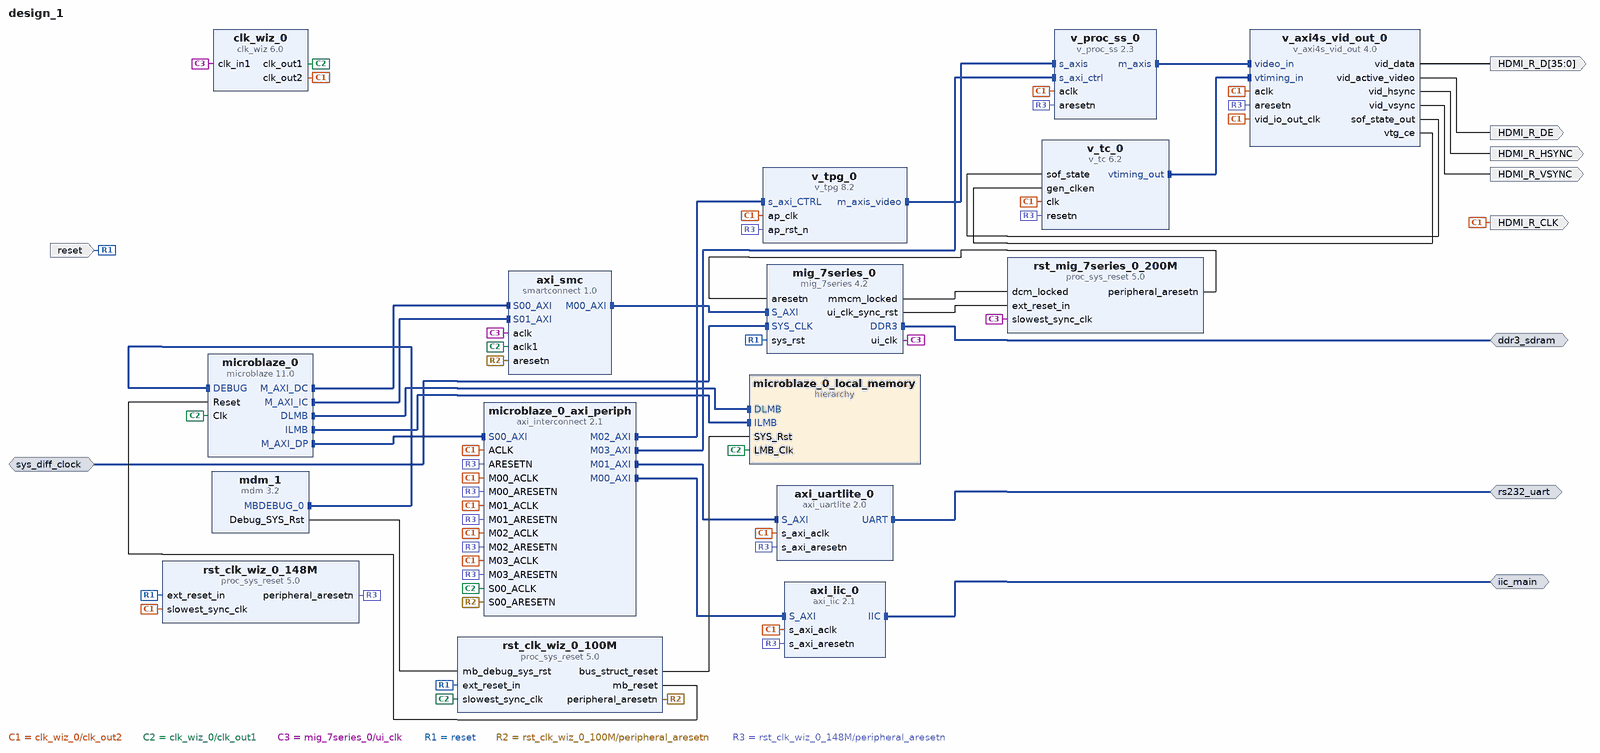
[diagram p0: block diagram of the top level]
# Vivado block design design_1, xc7vx485tffg1761-2, Vivado 2023.2
create_bd_design design_1

create_bd_intf_port -mode Master -vlnv xilinx.com:interface:ddrx_rtl:1.0 ddr3_sdram
create_bd_intf_port -mode Slave -vlnv xilinx.com:interface:diff_clock_rtl:1.0 sys_diff_clock
create_bd_intf_port -mode Master -vlnv xilinx.com:interface:iic_rtl:1.0 iic_main
create_bd_intf_port -mode Master -vlnv xilinx.com:interface:uart_rtl:1.0 rs232_uart
create_bd_port -dir O HDMI_R_DE
create_bd_port -dir O -from 35 -to 0 HDMI_R_D
create_bd_port -dir O HDMI_R_HSYNC
create_bd_port -dir O HDMI_R_VSYNC
create_bd_port -dir I -type rst reset
set_property -dict {CONFIG.POLARITY ACTIVE_HIGH} [get_bd_ports reset]
create_bd_port -dir O -type clk HDMI_R_CLK

create_bd_cell -type ip -vlnv xilinx.com:ip:v_proc_ss:2.3 v_proc_ss_0
set_property -dict [list \
  CONFIG.C_COLORSPACE_SUPPORT 2 \
  CONFIG.C_MAX_DATA_WIDTH 12 \
  CONFIG.C_SAMPLES_PER_CLK 1 \
  CONFIG.C_TOPOLOGY 3 \
] [get_bd_cells v_proc_ss_0]
create_bd_cell -type ip -vlnv xilinx.com:ip:v_axi4s_vid_out:4.0 v_axi4s_vid_out_0
set_property -dict [list \
  CONFIG.C_HAS_ASYNC_CLK 1 \
  CONFIG.C_NATIVE_COMPONENT_WIDTH 12 \
  CONFIG.C_S_AXIS_VIDEO_FORMAT 2 \
] [get_bd_cells v_axi4s_vid_out_0]
create_bd_cell -type ip -vlnv xilinx.com:ip:axi_uartlite:2.0 axi_uartlite_0
set_property -dict {CONFIG.UARTLITE_BOARD_INTERFACE rs232_uart CONFIG.USE_BOARD_FLOW true} [get_bd_cells axi_uartlite_0]
create_bd_cell -type ip -vlnv xilinx.com:ip:axi_iic:2.1 axi_iic_0
set_property -dict {CONFIG.IIC_BOARD_INTERFACE iic_main CONFIG.USE_BOARD_FLOW true} [get_bd_cells axi_iic_0]
create_bd_cell -type ip -vlnv xilinx.com:ip:mig_7series:4.2 mig_7series_0
set_property -dict {CONFIG.BOARD_MIG_PARAM ddr3_sdram CONFIG.RESET_BOARD_INTERFACE reset} [get_bd_cells mig_7series_0]
create_bd_cell -type ip -vlnv xilinx.com:ip:v_tc:6.2 v_tc_0
set_property -dict {CONFIG.HAS_AXI4_LITE false CONFIG.VIDEO_MODE 1080p CONFIG.enable_detection false} [get_bd_cells v_tc_0]
create_bd_cell -type ip -vlnv xilinx.com:ip:v_tpg:8.2 v_tpg_0
set_property -dict {CONFIG.MAX_DATA_WIDTH 12} [get_bd_cells v_tpg_0]
create_bd_cell -type ip -vlnv xilinx.com:ip:clk_wiz:6.0 clk_wiz_0
set_property -dict [list \
  CONFIG.CLKOUT1_JITTER 115.612 \
  CONFIG.CLKOUT1_PHASE_ERROR 87.466 \
  CONFIG.CLKOUT2_JITTER 107.413 \
  CONFIG.CLKOUT2_PHASE_ERROR 87.466 \
  CONFIG.CLKOUT2_REQUESTED_OUT_FREQ 148.5 \
  CONFIG.CLKOUT2_USED true \
  CONFIG.MMCM_CLKFBOUT_MULT_F 11.875 \
  CONFIG.MMCM_CLKOUT0_DIVIDE_F 11.875 \
  CONFIG.MMCM_CLKOUT1_DIVIDE 8 \
  CONFIG.NUM_OUT_CLKS 2 \
  CONFIG.USE_LOCKED false \
  CONFIG.USE_RESET false \
] [get_bd_cells clk_wiz_0]
create_bd_cell -type ip -vlnv xilinx.com:ip:microblaze:11.0 microblaze_0
set_property -dict [list \
  CONFIG.C_CACHE_BYTE_SIZE 8192 \
  CONFIG.C_DCACHE_BYTE_SIZE 8192 \
  CONFIG.C_DEBUG_ENABLED 1 \
  CONFIG.C_D_AXI 1 \
  CONFIG.C_D_LMB 1 \
  CONFIG.C_I_LMB 1 \
  CONFIG.C_USE_DCACHE 1 \
  CONFIG.C_USE_ICACHE 1 \
] [get_bd_cells microblaze_0]
create_bd_cell -type hier microblaze_0_local_memory
create_bd_cell -type ip -vlnv xilinx.com:ip:mdm:3.2 mdm_1
create_bd_cell -type ip -vlnv xilinx.com:ip:proc_sys_reset:5.0 rst_clk_wiz_0_100M
set_property -dict {CONFIG.RESET_BOARD_INTERFACE reset CONFIG.USE_BOARD_FLOW true} [get_bd_cells rst_clk_wiz_0_100M]
create_bd_cell -type ip -vlnv xilinx.com:ip:axi_interconnect:2.1 microblaze_0_axi_periph
set_property -dict {CONFIG.NUM_MI 4} [get_bd_cells microblaze_0_axi_periph]
create_bd_cell -type ip -vlnv xilinx.com:ip:proc_sys_reset:5.0 rst_clk_wiz_0_148M
set_property -dict {CONFIG.RESET_BOARD_INTERFACE reset CONFIG.USE_BOARD_FLOW true} [get_bd_cells rst_clk_wiz_0_148M]
create_bd_cell -type ip -vlnv xilinx.com:ip:smartconnect:1.0 axi_smc
set_property -dict {CONFIG.NUM_CLKS 2 CONFIG.NUM_SI 2} [get_bd_cells axi_smc]
create_bd_cell -type ip -vlnv xilinx.com:ip:proc_sys_reset:5.0 rst_mig_7series_0_200M

# ---- hierarchy /microblaze_0_local_memory ----
current_bd_instance /microblaze_0_local_memory
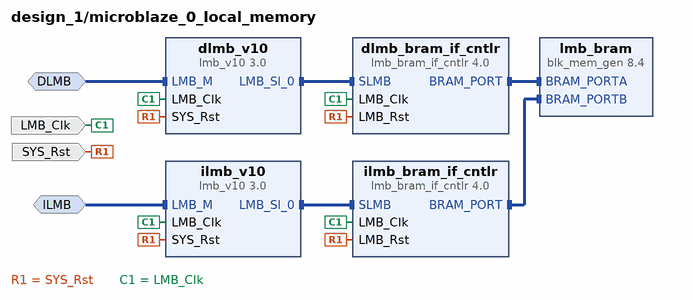
[diagram p1: block diagram inside /microblaze_0_local_memory]
create_bd_intf_pin -mode MirroredMaster -vlnv xilinx.com:interface:lmb_rtl:1.0 DLMB
create_bd_intf_pin -mode MirroredMaster -vlnv xilinx.com:interface:lmb_rtl:1.0 ILMB
create_bd_pin -dir I -type clk LMB_Clk
create_bd_pin -dir I -type rst SYS_Rst

create_bd_cell -type ip -vlnv xilinx.com:ip:lmb_v10:3.0 dlmb_v10
create_bd_cell -type ip -vlnv xilinx.com:ip:lmb_v10:3.0 ilmb_v10
create_bd_cell -type ip -vlnv xilinx.com:ip:lmb_bram_if_cntlr:4.0 dlmb_bram_if_cntlr
set_property -dict {CONFIG.C_ECC 0} [get_bd_cells dlmb_bram_if_cntlr]
create_bd_cell -type ip -vlnv xilinx.com:ip:lmb_bram_if_cntlr:4.0 ilmb_bram_if_cntlr
set_property -dict {CONFIG.C_ECC 0} [get_bd_cells ilmb_bram_if_cntlr]
create_bd_cell -type ip -vlnv xilinx.com:ip:blk_mem_gen:8.4 lmb_bram
set_property -dict {CONFIG.Memory_Type True_Dual_Port_RAM CONFIG.use_bram_block BRAM_Controller} [get_bd_cells lmb_bram]

# ---- connections ----

current_bd_instance /microblaze_0_local_memory
connect_bd_intf_net -intf_net microblaze_0_dlmb [get_bd_intf_pins dlmb_v10/LMB_M] [get_bd_intf_pins DLMB]
connect_bd_intf_net -intf_net microblaze_0_dlmb_bus [get_bd_intf_pins dlmb_v10/LMB_Sl_0] [get_bd_intf_pins dlmb_bram_if_cntlr/SLMB]
connect_bd_intf_net -intf_net microblaze_0_dlmb_cntlr [get_bd_intf_pins dlmb_bram_if_cntlr/BRAM_PORT] [get_bd_intf_pins lmb_bram/BRAM_PORTA]
connect_bd_intf_net -intf_net microblaze_0_ilmb [get_bd_intf_pins ilmb_v10/LMB_M] [get_bd_intf_pins ILMB]
connect_bd_intf_net -intf_net microblaze_0_ilmb_bus [get_bd_intf_pins ilmb_v10/LMB_Sl_0] [get_bd_intf_pins ilmb_bram_if_cntlr/SLMB]
connect_bd_intf_net -intf_net microblaze_0_ilmb_cntlr [get_bd_intf_pins ilmb_bram_if_cntlr/BRAM_PORT] [get_bd_intf_pins lmb_bram/BRAM_PORTB]
connect_bd_net [get_bd_pins SYS_Rst] \
  [get_bd_pins dlmb_v10/SYS_Rst] [get_bd_pins dlmb_bram_if_cntlr/LMB_Rst] [get_bd_pins ilmb_v10/SYS_Rst] \
  [get_bd_pins ilmb_bram_if_cntlr/LMB_Rst]
connect_bd_net -net microblaze_0_Clk [get_bd_pins LMB_Clk] \
  [get_bd_pins dlmb_v10/LMB_Clk] [get_bd_pins dlmb_bram_if_cntlr/LMB_Clk] [get_bd_pins ilmb_v10/LMB_Clk] \
  [get_bd_pins ilmb_bram_if_cntlr/LMB_Clk]
set_property HDL_ATTRIBUTE.BMM_INFO_ADDRESS_SPACE {byte  0x00000000 32 > design_1 microblaze_0_local_memory/lmb_bram} [get_bd_cells dlmb_bram_if_cntlr]
set_property HDL_ATTRIBUTE.KEEP_HIERARCHY yes [get_bd_cells dlmb_bram_if_cntlr]

current_bd_instance /
connect_bd_intf_net [get_bd_intf_ports iic_main] [get_bd_intf_pins axi_iic_0/IIC]
connect_bd_intf_net [get_bd_intf_pins axi_smc/M00_AXI] [get_bd_intf_pins mig_7series_0/S_AXI]
connect_bd_intf_net [get_bd_intf_ports rs232_uart] [get_bd_intf_pins axi_uartlite_0/UART]
connect_bd_intf_net [get_bd_intf_pins microblaze_0/M_AXI_DC] [get_bd_intf_pins axi_smc/S00_AXI]
connect_bd_intf_net [get_bd_intf_pins microblaze_0/M_AXI_DP] [get_bd_intf_pins microblaze_0_axi_periph/S00_AXI]
connect_bd_intf_net [get_bd_intf_pins microblaze_0/M_AXI_IC] [get_bd_intf_pins axi_smc/S01_AXI]
connect_bd_intf_net [get_bd_intf_pins microblaze_0_axi_periph/M00_AXI] [get_bd_intf_pins axi_iic_0/S_AXI]
connect_bd_intf_net [get_bd_intf_pins microblaze_0_axi_periph/M01_AXI] [get_bd_intf_pins axi_uartlite_0/S_AXI]
connect_bd_intf_net [get_bd_intf_pins microblaze_0_axi_periph/M02_AXI] [get_bd_intf_pins v_tpg_0/s_axi_CTRL]
connect_bd_intf_net [get_bd_intf_pins microblaze_0_axi_periph/M03_AXI] [get_bd_intf_pins v_proc_ss_0/s_axi_ctrl]
connect_bd_intf_net [get_bd_intf_pins mdm_1/MBDEBUG_0] [get_bd_intf_pins microblaze_0/DEBUG]
connect_bd_intf_net [get_bd_intf_pins microblaze_0/DLMB] [get_bd_intf_pins microblaze_0_local_memory/DLMB]
connect_bd_intf_net [get_bd_intf_pins microblaze_0/ILMB] [get_bd_intf_pins microblaze_0_local_memory/ILMB]
connect_bd_intf_net [get_bd_intf_ports ddr3_sdram] [get_bd_intf_pins mig_7series_0/DDR3]
connect_bd_intf_net [get_bd_intf_ports sys_diff_clock] [get_bd_intf_pins mig_7series_0/SYS_CLK]
connect_bd_intf_net [get_bd_intf_pins v_proc_ss_0/m_axis] [get_bd_intf_pins v_axi4s_vid_out_0/video_in]
connect_bd_intf_net [get_bd_intf_pins v_tc_0/vtiming_out] [get_bd_intf_pins v_axi4s_vid_out_0/vtiming_in]
connect_bd_intf_net [get_bd_intf_pins v_tpg_0/m_axis_video] [get_bd_intf_pins v_proc_ss_0/s_axis]
connect_bd_net [get_bd_pins clk_wiz_0/clk_out2] \
  [get_bd_pins microblaze_0_axi_periph/ACLK] [get_bd_pins axi_iic_0/s_axi_aclk] \
  [get_bd_pins microblaze_0_axi_periph/M00_ACLK] [get_bd_pins rst_clk_wiz_0_148M/slowest_sync_clk] \
  [get_bd_pins axi_uartlite_0/s_axi_aclk] [get_bd_pins microblaze_0_axi_periph/M01_ACLK] [get_bd_pins v_axi4s_vid_out_0/aclk] \
  [get_bd_pins v_proc_ss_0/aclk] [get_bd_pins v_tc_0/clk] [get_bd_pins v_tpg_0/ap_clk] \
  [get_bd_pins microblaze_0_axi_periph/M02_ACLK] [get_bd_pins v_axi4s_vid_out_0/vid_io_out_clk] [get_bd_ports HDMI_R_CLK] \
  [get_bd_pins microblaze_0_axi_periph/M03_ACLK]
connect_bd_net [get_bd_pins mdm_1/Debug_SYS_Rst] [get_bd_pins rst_clk_wiz_0_100M/mb_debug_sys_rst]
connect_bd_net -net microblaze_0_Clk [get_bd_pins clk_wiz_0/clk_out1] \
  [get_bd_pins microblaze_0/Clk] [get_bd_pins microblaze_0_local_memory/LMB_Clk] \
  [get_bd_pins rst_clk_wiz_0_100M/slowest_sync_clk] [get_bd_pins microblaze_0_axi_periph/S00_ACLK] \
  [get_bd_pins axi_smc/aclk1]
connect_bd_net [get_bd_pins mig_7series_0/mmcm_locked] [get_bd_pins rst_mig_7series_0_200M/dcm_locked]
connect_bd_net [get_bd_pins mig_7series_0/ui_clk] \
  [get_bd_pins clk_wiz_0/clk_in1] [get_bd_pins axi_smc/aclk] [get_bd_pins rst_mig_7series_0_200M/slowest_sync_clk]
connect_bd_net [get_bd_pins mig_7series_0/ui_clk_sync_rst] [get_bd_pins rst_mig_7series_0_200M/ext_reset_in]
connect_bd_net [get_bd_ports reset] \
  [get_bd_pins mig_7series_0/sys_rst] [get_bd_pins rst_clk_wiz_0_100M/ext_reset_in] \
  [get_bd_pins rst_clk_wiz_0_148M/ext_reset_in]
connect_bd_net [get_bd_pins rst_clk_wiz_0_100M/bus_struct_reset] [get_bd_pins microblaze_0_local_memory/SYS_Rst]
connect_bd_net [get_bd_pins rst_clk_wiz_0_100M/mb_reset] [get_bd_pins microblaze_0/Reset]
connect_bd_net [get_bd_pins rst_clk_wiz_0_100M/peripheral_aresetn] [get_bd_pins microblaze_0_axi_periph/S00_ARESETN] [get_bd_pins axi_smc/aresetn]
connect_bd_net [get_bd_pins rst_clk_wiz_0_148M/peripheral_aresetn] \
  [get_bd_pins axi_iic_0/s_axi_aresetn] [get_bd_pins microblaze_0_axi_periph/M00_ARESETN] \
  [get_bd_pins microblaze_0_axi_periph/ARESETN] [get_bd_pins axi_uartlite_0/s_axi_aresetn] \
  [get_bd_pins microblaze_0_axi_periph/M01_ARESETN] [get_bd_pins v_axi4s_vid_out_0/aresetn] [get_bd_pins v_proc_ss_0/aresetn] \
  [get_bd_pins v_tc_0/resetn] [get_bd_pins v_tpg_0/ap_rst_n] [get_bd_pins microblaze_0_axi_periph/M02_ARESETN] \
  [get_bd_pins microblaze_0_axi_periph/M03_ARESETN]
connect_bd_net [get_bd_pins rst_mig_7series_0_200M/peripheral_aresetn] [get_bd_pins mig_7series_0/aresetn]
connect_bd_net [get_bd_pins v_axi4s_vid_out_0/sof_state_out] [get_bd_pins v_tc_0/sof_state]
connect_bd_net [get_bd_pins v_axi4s_vid_out_0/vid_active_video] [get_bd_ports HDMI_R_DE]
connect_bd_net [get_bd_pins v_axi4s_vid_out_0/vid_data] [get_bd_ports HDMI_R_D]
connect_bd_net [get_bd_pins v_axi4s_vid_out_0/vid_hsync] [get_bd_ports HDMI_R_HSYNC]
connect_bd_net [get_bd_pins v_axi4s_vid_out_0/vid_vsync] [get_bd_ports HDMI_R_VSYNC]
connect_bd_net [get_bd_pins v_axi4s_vid_out_0/vtg_ce] [get_bd_pins v_tc_0/gen_clken]
set_property HDL_ATTRIBUTE.BMM_INFO_PROCESSOR {microblaze-le > design_1 microblaze_0_local_memory/dlmb_bram_if_cntlr} [get_bd_cells microblaze_0]
set_property HDL_ATTRIBUTE.KEEP_HIERARCHY yes [get_bd_cells microblaze_0]

# ---- address map ----
assign_bd_address -offset 0x00000000 -range 16K -target_address_space [get_bd_addr_spaces microblaze_0/Data] [get_bd_addr_segs microblaze_0_local_memory/dlmb_bram_if_cntlr/SLMB/Mem]
assign_bd_address -offset 0x40600000 -range 64K -target_address_space [get_bd_addr_spaces microblaze_0/Data] [get_bd_addr_segs axi_uartlite_0/S_AXI/Reg]
assign_bd_address -offset 0x40800000 -range 64K -target_address_space [get_bd_addr_spaces microblaze_0/Data] [get_bd_addr_segs axi_iic_0/S_AXI/Reg]
assign_bd_address -offset 0x44A00000 -range 64K -target_address_space [get_bd_addr_spaces microblaze_0/Data] [get_bd_addr_segs v_tpg_0/s_axi_CTRL/Reg]
assign_bd_address -offset 0x44A10000 -range 64K -target_address_space [get_bd_addr_spaces microblaze_0/Data] [get_bd_addr_segs v_proc_ss_0/s_axi_ctrl/Reg]
assign_bd_address -offset 0x80000000 -range 1G -target_address_space [get_bd_addr_spaces microblaze_0/Data] [get_bd_addr_segs mig_7series_0/memmap/memaddr]
assign_bd_address -offset 0x00000000 -range 16K -target_address_space [get_bd_addr_spaces microblaze_0/Instruction] [get_bd_addr_segs microblaze_0_local_memory/ilmb_bram_if_cntlr/SLMB/Mem]
assign_bd_address -offset 0x80000000 -range 1G -target_address_space [get_bd_addr_spaces microblaze_0/Instruction] [get_bd_addr_segs mig_7series_0/memmap/memaddr]

validate_bd_design
save_bd_design
